# Altium schematic sheet HL_SnapIn_Base.SchDoc
size A4
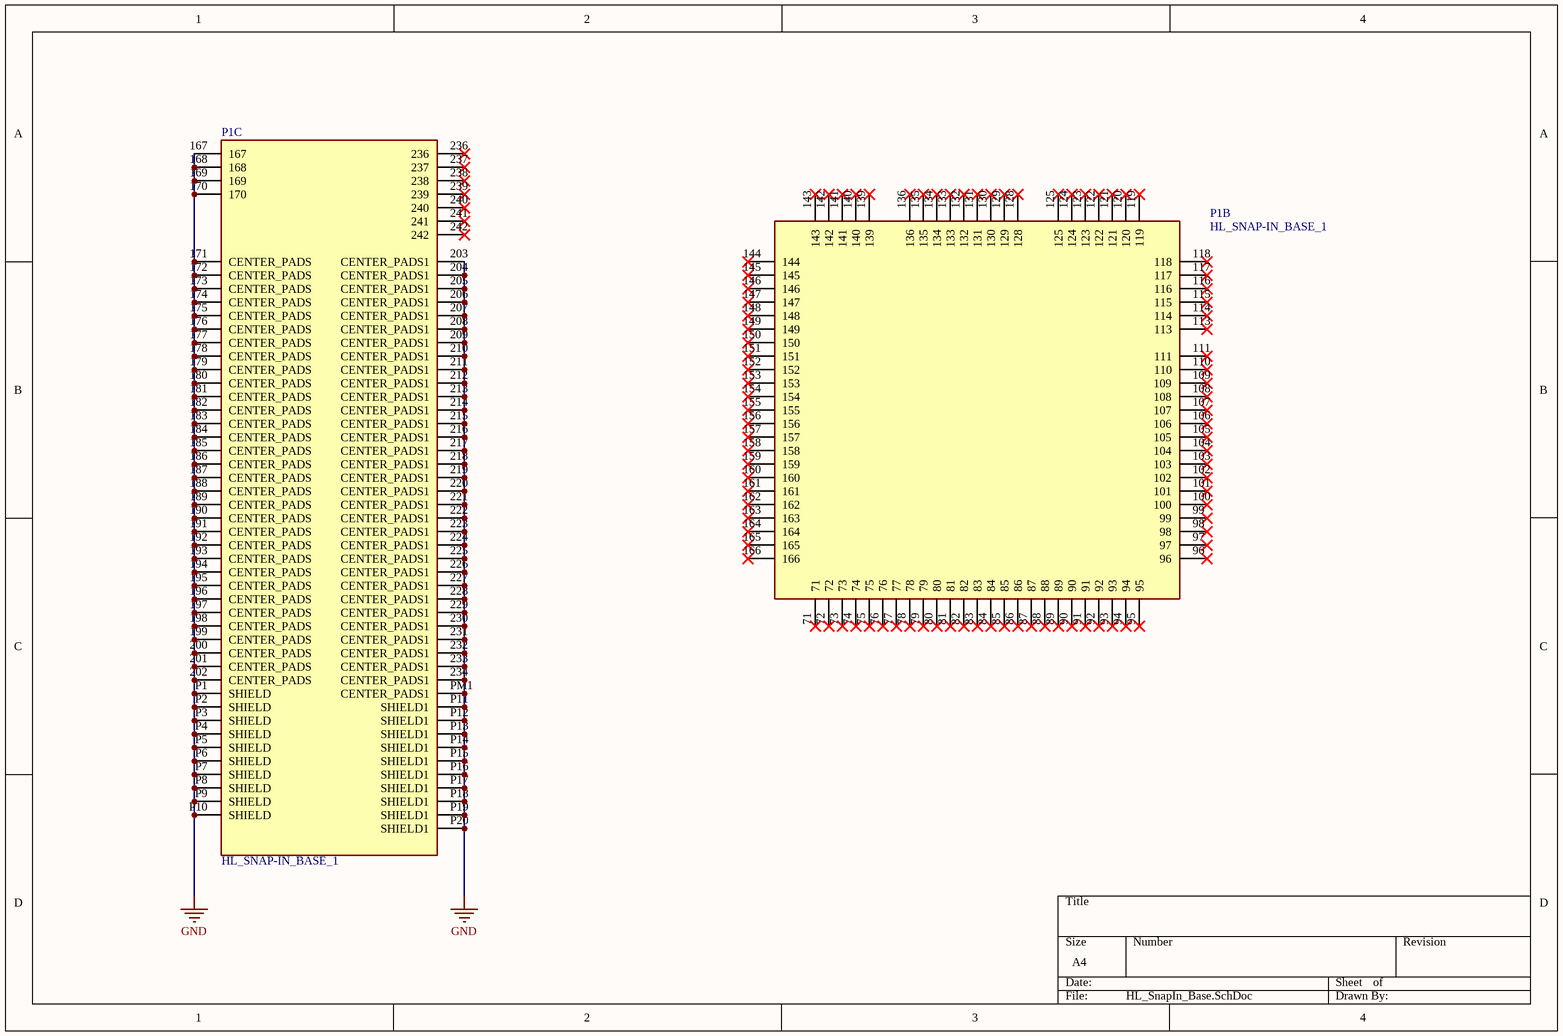
[diagram p0: HL_SnapIn_Base.SchDoc]

## Parts
P1  HL_SNAP-IN_BASE_1  [SIERRA_WP_SNAP-IN_BASE]  (parts B,C of 3)

## Nets
GND: P1.167 P1.168 P1.169 P1.170 P1.171(CENTER_PADS) P1.172(CENTER_PADS) P1.173(CENTER_PADS) P1.174(CENTER_PADS) P1.175(CENTER_PADS) P1.176(CENTER_PADS) P1.177(CENTER_PADS) P1.178(CENTER_PADS) P1.179(CENTER_PADS) P1.180(CENTER_PADS) P1.181(CENTER_PADS) P1.182(CENTER_PADS) P1.183(CENTER_PADS) P1.184(CENTER_PADS) P1.185(CENTER_PADS) P1.186(CENTER_PADS) P1.187(CENTER_PADS) P1.188(CENTER_PADS) P1.189(CENTER_PADS) P1.190(CENTER_PADS) P1.191(CENTER_PADS) P1.192(CENTER_PADS) P1.193(CENTER_PADS) P1.194(CENTER_PADS) P1.195(CENTER_PADS) P1.196(CENTER_PADS) P1.197(CENTER_PADS) P1.198(CENTER_PADS) P1.199(CENTER_PADS) P1.200(CENTER_PADS) P1.201(CENTER_PADS) P1.202(CENTER_PADS) P1.203(CENTER_PADS1) P1.204(CENTER_PADS1) P1.205(CENTER_PADS1) P1.206(CENTER_PADS1) P1.207(CENTER_PADS1) P1.208(CENTER_PADS1) P1.209(CENTER_PADS1) P1.210(CENTER_PADS1) P1.211(CENTER_PADS1) P1.212(CENTER_PADS1) P1.213(CENTER_PADS1) P1.214(CENTER_PADS1) P1.215(CENTER_PADS1) P1.216(CENTER_PADS1) P1.217(CENTER_PADS1) P1.218(CENTER_PADS1) P1.219(CENTER_PADS1) P1.220(CENTER_PADS1) P1.221(CENTER_PADS1) P1.222(CENTER_PADS1) P1.223(CENTER_PADS1) P1.224(CENTER_PADS1) P1.225(CENTER_PADS1) P1.226(CENTER_PADS1) P1.227(CENTER_PADS1) P1.228(CENTER_PADS1) P1.229(CENTER_PADS1) P1.230(CENTER_PADS1) P1.231(CENTER_PADS1) P1.232(CENTER_PADS1) P1.233(CENTER_PADS1) P1.234(CENTER_PADS1) P1.P1(SHIELD) P1.P2(SHIELD) P1.P3(SHIELD) P1.P4(SHIELD) P1.P5(SHIELD) P1.P6(SHIELD) P1.P7(SHIELD) P1.P8(SHIELD) P1.P9(SHIELD) P1.P10(SHIELD) P1.P11(SHIELD1) P1.P12(SHIELD1) P1.P13(SHIELD1) P1.P14(SHIELD1) P1.P15(SHIELD1) P1.P16(SHIELD1) P1.P17(SHIELD1) P1.P18(SHIELD1) P1.P19(SHIELD1) P1.P20(SHIELD1) P1.PM1(CENTER_PADS1)

Not connected (* = marked no-connect by the designer): P1 71* 72* 73* 74* 75* 76* 77* 78* 79* 80* 81* 82* 83* 84* 85* 86* 87* 88* 89* 90* 91* 92* 93* 94* 95* 96* 97* 98* 99* 100* 101* 102* 103* 104* 105* 106* 107* 108* 109* 110* 111* 113* 114* 115* 116* 117* 118* 119* 120* 121* 122* 123* 124* 125* 128* 129* 130* 131* 132* 133* 134* 135* 136* 139* 140* 141* 142* 143* 144* 145* 146* 147* 148* 149* 150* 151* 152* 153* 154* 155* 156* 157* 158* 159* 160* 161* 162* 163* 164* 165* 166* 236* 237* 238* 239* 240* 241* 242*

## Library data of the parts
P1 = HL_SNAP-IN_BASE_1: WP SNAP IN SOCKET BASE FRAME 157 / HL7650; MF: Sierra Wireless; MP: WP SNAP-IN BASE; Availability: Unavailable; SnapEDA_Link: https://www.snapeda.com/parts/WP%20SNAP-IN%20BASE/Sierra%20Wireless/view-part/1245533/?ref=snap; Price: None; Package: None; Value: *